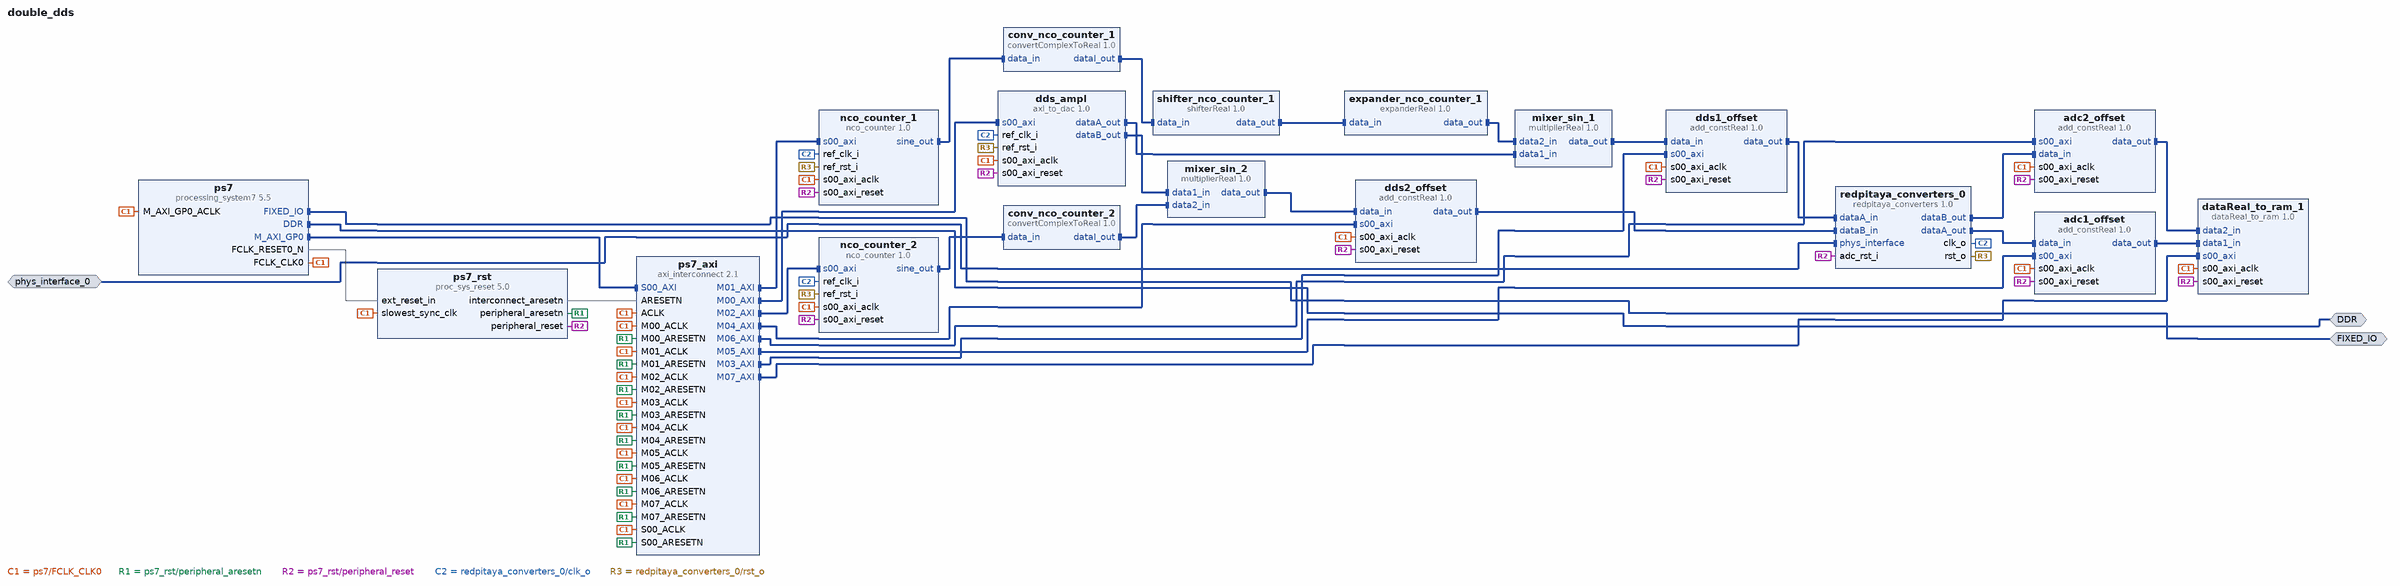
[diagram p0: block diagram of the top level]
# Vivado block design double_dds, xc7z010clg400-1, Vivado 2019.2
create_bd_design double_dds

create_bd_intf_port -mode Master -vlnv xilinx.com:interface:ddrx_rtl:1.0 DDR
create_bd_intf_port -mode Master -vlnv xilinx.com:display_processing_system7:fixedio_rtl:1.0 FIXED_IO
create_bd_intf_port -mode Slave -vlnv ggm:interface:redpitaya_converters_if_rtl:1.0 phys_interface_0

create_bd_cell -type ip -vlnv xilinx.com:ip:processing_system7:5.5 ps7
set_property -dict [list \
  CONFIG.PCW_APU_PERIPHERAL_FREQMHZ 666.666666 \
  CONFIG.PCW_ENET0_ENET0_IO {MIO 16 .. 27} \
  CONFIG.PCW_ENET0_GRP_MDIO_ENABLE 1 \
  CONFIG.PCW_ENET0_GRP_MDIO_IO EMIO \
  CONFIG.PCW_ENET0_PERIPHERAL_ENABLE 1 \
  CONFIG.PCW_ENET0_RESET_ENABLE 0 \
  CONFIG.PCW_ENET_RESET_ENABLE 1 \
  CONFIG.PCW_ENET_RESET_SELECT {Share reset pin} \
  CONFIG.PCW_FPGA0_PERIPHERAL_FREQMHZ 125.000000 \
  CONFIG.PCW_FPGA1_PERIPHERAL_FREQMHZ 250.000000 \
  CONFIG.PCW_FPGA3_PERIPHERAL_FREQMHZ 200.000000 \
  CONFIG.PCW_GPIO_MIO_GPIO_ENABLE 1 \
  CONFIG.PCW_GPIO_MIO_GPIO_IO MIO \
  CONFIG.PCW_GPIO_PERIPHERAL_ENABLE 1 \
  CONFIG.PCW_I2C0_GRP_INT_ENABLE 0 \
  CONFIG.PCW_I2C0_I2C0_IO {MIO 50 .. 51} \
  CONFIG.PCW_I2C0_PERIPHERAL_ENABLE 1 \
  CONFIG.PCW_I2C_PERIPHERAL_FREQMHZ 111.111115 \
  CONFIG.PCW_I2C_RESET_ENABLE 1 \
  CONFIG.PCW_I2C_RESET_SELECT {Share reset pin} \
  CONFIG.PCW_IMPORT_BOARD_PRESET /home/bma/git/github/oscimpDigital/fpga_ip/preset/redpitaya_preset.xml \
  CONFIG.PCW_PRESET_BANK1_VOLTAGE {LVCMOS 2.5V} \
  CONFIG.PCW_QSPI_GRP_SINGLE_SS_ENABLE 1 \
  CONFIG.PCW_QSPI_GRP_SINGLE_SS_IO {MIO 1 .. 6} \
  CONFIG.PCW_QSPI_PERIPHERAL_ENABLE 1 \
  CONFIG.PCW_QSPI_PERIPHERAL_FREQMHZ 125 \
  CONFIG.PCW_QSPI_QSPI_IO {MIO 1 .. 6} \
  CONFIG.PCW_SD0_GRP_CD_ENABLE 1 \
  CONFIG.PCW_SD0_GRP_CD_IO {MIO 46} \
  CONFIG.PCW_SD0_GRP_WP_ENABLE 1 \
  CONFIG.PCW_SD0_GRP_WP_IO {MIO 47} \
  CONFIG.PCW_SD0_PERIPHERAL_ENABLE 1 \
  CONFIG.PCW_SD0_SD0_IO {MIO 40 .. 45} \
  CONFIG.PCW_SDIO_PERIPHERAL_FREQMHZ 100 \
  CONFIG.PCW_SINGLE_QSPI_DATA_MODE x4 \
  CONFIG.PCW_SPI0_PERIPHERAL_ENABLE 1 \
  CONFIG.PCW_SPI0_SPI0_IO EMIO \
  CONFIG.PCW_SPI1_PERIPHERAL_ENABLE 1 \
  CONFIG.PCW_SPI1_SPI1_IO {MIO 10 .. 15} \
  CONFIG.PCW_TTC0_PERIPHERAL_ENABLE 1 \
  CONFIG.PCW_TTC0_TTC0_IO EMIO \
  CONFIG.PCW_UART0_PERIPHERAL_ENABLE 1 \
  CONFIG.PCW_UART0_UART0_IO {MIO 14 .. 15} \
  CONFIG.PCW_UART1_PERIPHERAL_ENABLE 1 \
  CONFIG.PCW_UART1_UART1_IO {MIO 8 .. 9} \
  CONFIG.PCW_UART_PERIPHERAL_FREQMHZ 100 \
  CONFIG.PCW_UIPARAM_DDR_BUS_WIDTH {16 Bit} \
  CONFIG.PCW_UIPARAM_DDR_FREQ_MHZ 533.333333 \
  CONFIG.PCW_UIPARAM_DDR_PARTNO {MT41J256M16 RE-125} \
  CONFIG.PCW_USB0_PERIPHERAL_ENABLE 1 \
  CONFIG.PCW_USB0_RESET_ENABLE 1 \
  CONFIG.PCW_USB0_RESET_IO {MIO 48} \
  CONFIG.PCW_USB0_USB0_IO {MIO 28 .. 39} \
  CONFIG.PCW_USB_RESET_ENABLE 1 \
  CONFIG.PCW_USB_RESET_SELECT {Share reset pin} \
] [get_bd_cells ps7]
# 429 more settings of ps7 are not shown: defaults, MIO pin electricals, DDR timing, and values the tool derives
create_bd_cell -type ip -vlnv xilinx.com:ip:proc_sys_reset:5.0 ps7_rst
create_bd_cell -type ip -vlnv ggm:cogen:redpitaya_converters:1.0 redpitaya_converters_0
set_property -dict {CONFIG.CLOCK_DUTY_CYCLE_STABILIZER_EN false} [get_bd_cells redpitaya_converters_0]
create_bd_cell -type ip -vlnv ggm:cogen:axi_to_dac:1.0 dds_ampl
create_bd_cell -type ip -vlnv xilinx.com:ip:axi_interconnect:2.1 ps7_axi
set_property -dict {CONFIG.NUM_MI 8} [get_bd_cells ps7_axi]
create_bd_cell -type ip -vlnv ggm:cogen:nco_counter:1.0 nco_counter_1
set_property -dict {CONFIG.COUNTER_SIZE 40 CONFIG.LUT_SIZE 12} [get_bd_cells nco_counter_1]
create_bd_cell -type ip -vlnv ggm:cogen:convertComplexToReal:1.0 conv_nco_counter_1
set_property -dict {CONFIG.DATA_SIZE 16} [get_bd_cells conv_nco_counter_1]
create_bd_cell -type ip -vlnv ggm:cogen:shifterReal:1.0 shifter_nco_counter_1
set_property -dict {CONFIG.DATA_IN_SIZE 16 CONFIG.DATA_OUT_SIZE 1} [get_bd_cells shifter_nco_counter_1]
create_bd_cell -type ip -vlnv ggm:cogen:expanderReal:1.0 expander_nco_counter_1
set_property -dict {CONFIG.DATA_IN_SIZE 1 CONFIG.DATA_OUT_SIZE 16} [get_bd_cells expander_nco_counter_1]
create_bd_cell -type ip -vlnv ggm:cogen:nco_counter:1.0 nco_counter_2
set_property -dict {CONFIG.COUNTER_SIZE 40 CONFIG.LUT_SIZE 12} [get_bd_cells nco_counter_2]
create_bd_cell -type ip -vlnv ggm:cogen:convertComplexToReal:1.0 conv_nco_counter_2
set_property -dict {CONFIG.DATA_SIZE 16} [get_bd_cells conv_nco_counter_2]
create_bd_cell -type ip -vlnv ggm:cogen:multiplierReal:1.0 mixer_sin_1
set_property -dict {CONFIG.DATA1_IN_SIZE 14 CONFIG.DATA2_IN_SIZE 16 CONFIG.DATA_OUT_SIZE 14} [get_bd_cells mixer_sin_1]
create_bd_cell -type ip -vlnv ggm:cogen:multiplierReal:1.0 mixer_sin_2
set_property -dict {CONFIG.DATA1_IN_SIZE 14 CONFIG.DATA2_IN_SIZE 16 CONFIG.DATA_OUT_SIZE 14} [get_bd_cells mixer_sin_2]
create_bd_cell -type ip -vlnv ggm:cogen:add_constReal:1.0 dds1_offset
set_property -dict {CONFIG.DATA_IN_SIZE 14 CONFIG.DATA_OUT_SIZE 14} [get_bd_cells dds1_offset]
create_bd_cell -type ip -vlnv ggm:cogen:add_constReal:1.0 dds2_offset
set_property -dict {CONFIG.DATA_IN_SIZE 14 CONFIG.DATA_OUT_SIZE 14} [get_bd_cells dds2_offset]
create_bd_cell -type ip -vlnv ggm:cogen:add_constReal:1.0 adc1_offset
set_property -dict {CONFIG.DATA_IN_SIZE 14 CONFIG.DATA_OUT_SIZE 14} [get_bd_cells adc1_offset]
create_bd_cell -type ip -vlnv ggm:cogen:add_constReal:1.0 adc2_offset
set_property -dict {CONFIG.DATA_IN_SIZE 14 CONFIG.DATA_OUT_SIZE 14} [get_bd_cells adc2_offset]
create_bd_cell -type ip -vlnv ggm:cogen:dataReal_to_ram:1.0 dataReal_to_ram_1
set_property -dict {CONFIG.DATA_SIZE 14 CONFIG.NB_INPUT 2 CONFIG.NB_SAMPLE 8192} [get_bd_cells dataReal_to_ram_1]

# ---- connections ----

connect_bd_intf_net [get_bd_intf_pins dds1_offset/data_out] [get_bd_intf_pins redpitaya_converters_0/dataA_in]
connect_bd_intf_net [get_bd_intf_pins mixer_sin_1/data_out] [get_bd_intf_pins dds1_offset/data_in]
connect_bd_intf_net [get_bd_intf_pins ps7_axi/M04_AXI] [get_bd_intf_pins dds2_offset/s00_axi]
connect_bd_intf_net [get_bd_intf_pins expander_nco_counter_1/data_out] [get_bd_intf_pins mixer_sin_1/data2_in]
connect_bd_intf_net [get_bd_intf_pins dds_ampl/dataA_out] [get_bd_intf_pins mixer_sin_1/data1_in]
connect_bd_intf_net [get_bd_intf_pins ps7_axi/M02_AXI] [get_bd_intf_pins nco_counter_2/s00_axi]
connect_bd_intf_net [get_bd_intf_pins ps7_axi/M06_AXI] [get_bd_intf_pins adc2_offset/s00_axi]
connect_bd_intf_net [get_bd_intf_pins mixer_sin_2/data_out] [get_bd_intf_pins dds2_offset/data_in]
connect_bd_intf_net [get_bd_intf_pins nco_counter_2/sine_out] [get_bd_intf_pins conv_nco_counter_2/data_in]
connect_bd_intf_net [get_bd_intf_pins ps7_axi/M05_AXI] [get_bd_intf_pins adc1_offset/s00_axi]
connect_bd_intf_net [get_bd_intf_pins redpitaya_converters_0/dataA_out] [get_bd_intf_pins adc1_offset/data_in]
connect_bd_intf_net [get_bd_intf_pins shifter_nco_counter_1/data_out] [get_bd_intf_pins expander_nco_counter_1/data_in]
connect_bd_intf_net [get_bd_intf_pins nco_counter_1/sine_out] [get_bd_intf_pins conv_nco_counter_1/data_in]
connect_bd_intf_net [get_bd_intf_pins ps7_axi/M01_AXI] [get_bd_intf_pins nco_counter_1/s00_axi]
connect_bd_intf_net [get_bd_intf_pins conv_nco_counter_1/dataI_out] [get_bd_intf_pins shifter_nco_counter_1/data_in]
connect_bd_intf_net [get_bd_intf_pins redpitaya_converters_0/dataB_out] [get_bd_intf_pins adc2_offset/data_in]
connect_bd_intf_net [get_bd_intf_pins ps7/M_AXI_GP0] [get_bd_intf_pins ps7_axi/S00_AXI]
connect_bd_intf_net [get_bd_intf_pins ps7_axi/M00_AXI] [get_bd_intf_pins dds_ampl/s00_axi]
connect_bd_intf_net [get_bd_intf_pins ps7_axi/M03_AXI] [get_bd_intf_pins dds1_offset/s00_axi]
connect_bd_intf_net [get_bd_intf_pins dds2_offset/data_out] [get_bd_intf_pins redpitaya_converters_0/dataB_in]
connect_bd_intf_net [get_bd_intf_pins dds_ampl/dataB_out] [get_bd_intf_pins mixer_sin_2/data1_in]
connect_bd_intf_net [get_bd_intf_pins conv_nco_counter_2/dataI_out] [get_bd_intf_pins mixer_sin_2/data2_in]
connect_bd_intf_net -intf_net phys_interface_0_1 [get_bd_intf_ports phys_interface_0] [get_bd_intf_pins redpitaya_converters_0/phys_interface]
connect_bd_intf_net [get_bd_intf_ports FIXED_IO] [get_bd_intf_pins ps7/FIXED_IO]
connect_bd_intf_net [get_bd_intf_ports DDR] [get_bd_intf_pins ps7/DDR]
connect_bd_intf_net [get_bd_intf_pins adc1_offset/data_out] [get_bd_intf_pins dataReal_to_ram_1/data1_in]
connect_bd_intf_net [get_bd_intf_pins adc2_offset/data_out] [get_bd_intf_pins dataReal_to_ram_1/data2_in]
connect_bd_intf_net [get_bd_intf_pins ps7_axi/M07_AXI] [get_bd_intf_pins dataReal_to_ram_1/s00_axi]
connect_bd_net [get_bd_pins ps7/FCLK_CLK0] \
  [get_bd_pins ps7/M_AXI_GP0_ACLK] [get_bd_pins ps7_rst/slowest_sync_clk] [get_bd_pins ps7_axi/ACLK] \
  [get_bd_pins ps7_axi/S00_ACLK] [get_bd_pins ps7_axi/M00_ACLK] [get_bd_pins dds_ampl/s00_axi_aclk] \
  [get_bd_pins ps7_axi/M01_ACLK] [get_bd_pins nco_counter_1/s00_axi_aclk] [get_bd_pins ps7_axi/M02_ACLK] \
  [get_bd_pins nco_counter_2/s00_axi_aclk] [get_bd_pins ps7_axi/M03_ACLK] [get_bd_pins dds1_offset/s00_axi_aclk] \
  [get_bd_pins ps7_axi/M04_ACLK] [get_bd_pins dds2_offset/s00_axi_aclk] [get_bd_pins ps7_axi/M05_ACLK] \
  [get_bd_pins adc1_offset/s00_axi_aclk] [get_bd_pins ps7_axi/M06_ACLK] [get_bd_pins adc2_offset/s00_axi_aclk] \
  [get_bd_pins ps7_axi/M07_ACLK] [get_bd_pins dataReal_to_ram_1/s00_axi_aclk]
connect_bd_net [get_bd_pins ps7/FCLK_RESET0_N] [get_bd_pins ps7_rst/ext_reset_in]
connect_bd_net [get_bd_pins ps7_rst/interconnect_aresetn] [get_bd_pins ps7_axi/ARESETN]
connect_bd_net [get_bd_pins ps7_rst/peripheral_aresetn] \
  [get_bd_pins ps7_axi/S00_ARESETN] [get_bd_pins ps7_axi/M00_ARESETN] [get_bd_pins ps7_axi/M01_ARESETN] \
  [get_bd_pins ps7_axi/M02_ARESETN] [get_bd_pins ps7_axi/M03_ARESETN] [get_bd_pins ps7_axi/M04_ARESETN] \
  [get_bd_pins ps7_axi/M05_ARESETN] [get_bd_pins ps7_axi/M06_ARESETN] [get_bd_pins ps7_axi/M07_ARESETN]
connect_bd_net [get_bd_pins ps7_rst/peripheral_reset] \
  [get_bd_pins dds_ampl/s00_axi_reset] [get_bd_pins nco_counter_1/s00_axi_reset] [get_bd_pins nco_counter_2/s00_axi_reset] \
  [get_bd_pins dds1_offset/s00_axi_reset] [get_bd_pins dds2_offset/s00_axi_reset] [get_bd_pins adc1_offset/s00_axi_reset] \
  [get_bd_pins adc2_offset/s00_axi_reset] [get_bd_pins dataReal_to_ram_1/s00_axi_reset] \
  [get_bd_pins redpitaya_converters_0/adc_rst_i]
connect_bd_net [get_bd_pins redpitaya_converters_0/clk_o] \
  [get_bd_pins dds_ampl/ref_clk_i] [get_bd_pins nco_counter_1/ref_clk_i] [get_bd_pins nco_counter_2/ref_clk_i]
connect_bd_net [get_bd_pins redpitaya_converters_0/rst_o] \
  [get_bd_pins dds_ampl/ref_rst_i] [get_bd_pins nco_counter_1/ref_rst_i] [get_bd_pins nco_counter_2/ref_rst_i]

# ---- address map ----
assign_bd_address -offset 0x43C00000 -range 4K -target_address_space [get_bd_addr_spaces ps7/Data] [get_bd_addr_segs dataReal_to_ram_1/s00_axi/reg0]
assign_bd_address -offset 0x43C10000 -range 4K -target_address_space [get_bd_addr_spaces ps7/Data] [get_bd_addr_segs dds_ampl/s00_axi/reg0]
assign_bd_address -offset 0x43C20000 -range 4K -target_address_space [get_bd_addr_spaces ps7/Data] [get_bd_addr_segs adc1_offset/s00_axi/reg0]
assign_bd_address -offset 0x43C40000 -range 4K -target_address_space [get_bd_addr_spaces ps7/Data] [get_bd_addr_segs adc2_offset/s00_axi/reg0]
assign_bd_address -offset 0x43C50000 -range 4K -target_address_space [get_bd_addr_spaces ps7/Data] [get_bd_addr_segs dds1_offset/s00_axi/reg0]
assign_bd_address -offset 0x43C60000 -range 4K -target_address_space [get_bd_addr_spaces ps7/Data] [get_bd_addr_segs dds2_offset/s00_axi/reg0]
assign_bd_address -offset 0x43C70000 -range 4K -target_address_space [get_bd_addr_spaces ps7/Data] [get_bd_addr_segs nco_counter_1/s00_axi/reg0]
assign_bd_address -offset 0x43C80000 -range 4K -target_address_space [get_bd_addr_spaces ps7/Data] [get_bd_addr_segs nco_counter_2/s00_axi/reg0]

validate_bd_design
save_bd_design
